# Altium project PCB_Project.PrjPcb
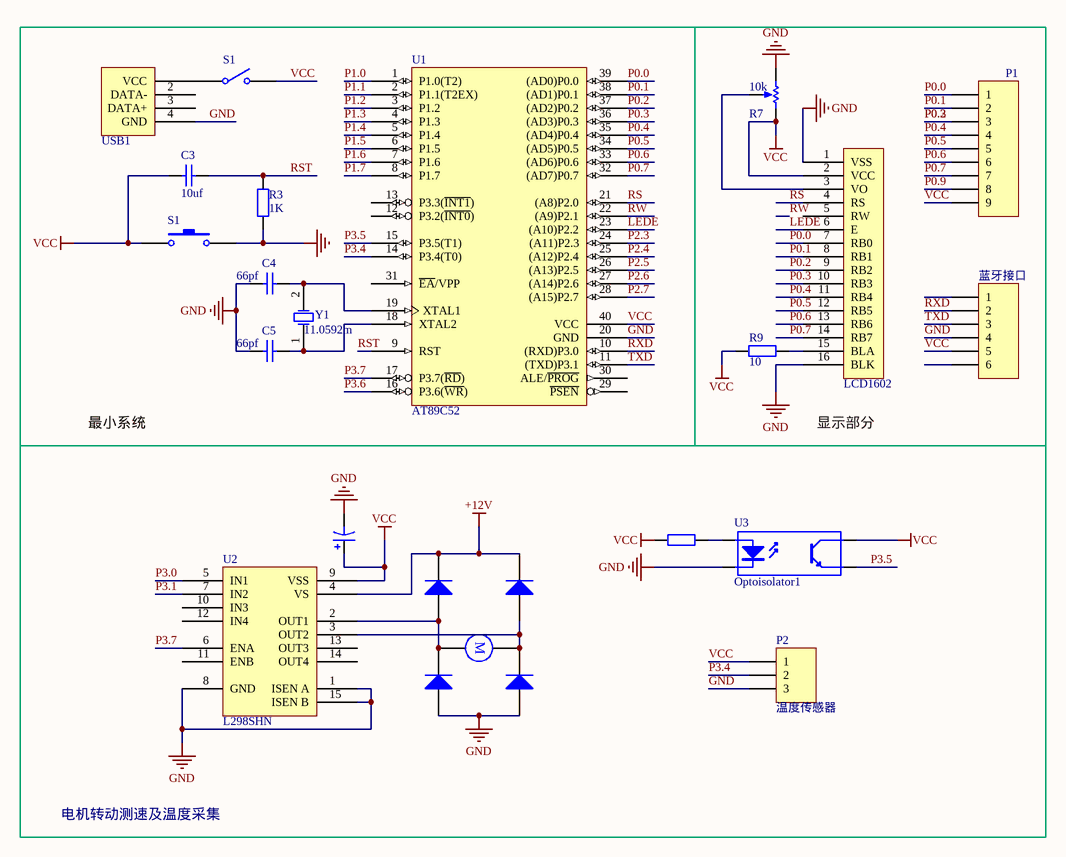
[diagram p0: Sheet1.SchDoc]
1 sheet, 24 parts. Net scope: global (net labels, ports and power ports of the same name join across sheets).

## Sheet Sheet1.SchDoc
size A4

### Parts
(Parts that share a designator on the sheet are numbered #1, #2 ... from top to bottom, then left to right.)
?  USB1  [HDR1X4H]
B?  Motor  [RB5-10.5]  (value not drawn)
C3  10uf  [电容]
C4  66pf  [电容]
C5  66pf  [电容]
C?  Cap Pol1  [RB7.6-15]  (value not drawn)
D?#1  Diode  [SMC]  (value not drawn)
D?#2  Diode  [SMC]  (value not drawn)
D?#3  Diode  [SMC]  (value not drawn)
D?#4  Diode  [SMC]  (value not drawn)
LCD1602  LCD1602  [LCD]  (value not drawn)
P1  Header 9  [paizhu]  (value not drawn)
P2  温度传感器  [HDR1X3H]
R3  1K  [RES]
R7  10k  [VR5]
R9  10  [AXIAL-0.4]
R?  Res2  [AXIAL-0.4]  (value not drawn)
S1#1  SW-SPST  [SPST-2]  (value not drawn)
S1#2  SW-PB  [swith]  (value not drawn)
U1  AT89C52  [AT89C51]
U2  L298SHN
U3  Optoisolator1  [DIP-4]
Y1  11.0592m  [jingti]
蓝牙接口  Header 6H  [HDR1X6H]  (value not drawn)

### Blocks framed on the sheet
最小系统: ? C3-C5 R3 S1#1 S1#2 U1 Y1

### Nets
+12V: D?#1.2(K) D?#2.2(K) U2.4(VS)
GND: ?.4(GND) C4.1 C5.1 C?.2 D?#3.1(A) D?#4.1(A) LCD1602.1(VSS) LCD1602.16(BLK) P2.3 R3.2 R7.1(TOP) S1#2.2 U1.20(GND) U2.1(ISEN_A) U2.8(GND) U2.15(ISEN_B) U3.2(K) 蓝牙接口.4
VCC: C3.2 C?.1 LCD1602.2(VCC) P1.9 P2.1 R7.2(BOT) R9.1 R?.1 S1#2.1 U1.40(VCC) U2.9(VSS) U3.4(C) 蓝牙接口.5
LEDE: LCD1602.6(E) U1.23((A10)P2.2)
P0.0: LCD1602.7(RB0) P1.1 U1.39((AD0)P0.0)
P0.1: LCD1602.8(RB1) P1.2 U1.38((AD1)P0.1)
P0.2: LCD1602.9(RB2) LCD1602.10(RB3) P1.3 U1.36((AD3)P0.3) U1.37((AD2)P0.2)  [also labelled P0.3]
P0.4: LCD1602.11(RB4) P1.4 U1.35((AD4)P0.4)
P0.5: LCD1602.12(RB5) P1.5 U1.34((AD5)P0.5)
P0.6: LCD1602.13(RB6) P1.6 U1.33((AD6)P0.6)
P0.7: LCD1602.14(RB7) P1.7 U1.32((AD7)P0.7)
P0.9: P1.8
P1.0: U1.1(P1.0(T2))
P1.1: U1.2(P1.1(T2EX))
P1.2: U1.3(P1.2)
P1.3: U1.4(P1.3)
P1.4: U1.5(P1.4)
P1.5: U1.6(P1.5)
P1.6: U1.7(P1.6)
P1.7: U1.8(P1.7)
P2.3: U1.24((A11)P2.3)
P2.4: U1.25((A12)P2.4)
P2.5: U1.26((A13)P2.5)
P2.6: U1.27((A14)P2.6)
P2.7: U1.28((A15)P2.7)
P3.0: U2.5(IN1)
P3.1: U2.7(IN2)
P3.4: P2.2 U1.14(P3.4(T0))
P3.5: U1.15(P3.5(T1)) U3.3(E)
P3.6: U1.16(P3.6(~{WR}))
P3.7: U1.17(P3.7(~{RD})) U2.6(ENA)
RS: LCD1602.4(RS) U1.21((A8)P2.0)
RST: C3.1 R3.1 U1.9(RST)
RW: U1.22((A9)P2.1)
RXD: U1.10((RXD)P3.0) 蓝牙接口.2
TXD: U1.11((TXD)P3.1) 蓝牙接口.3
Net?_1: ?.1(VCC) S1#1.1(COMMON)
NetB?_1: B?.1 D?#2.1(A) D?#4.2(K) U2.3(OUT2)
NetB?_2: B?.2 D?#1.1(A) D?#3.2(K) U2.2(OUT1)
NetC4_2: C4.2 U1.19(XTAL1) Y1.2(OSC2)
NetC5_2: C5.2 U1.18(XTAL2) Y1.1(OSC1)
NetLCD1602_3: LCD1602.3(VO) R7.3(TAP)
NetLCD1602_15: LCD1602.15(BLA) R9.2
NetR?_2: R?.2 U3.1(A)

Not connected (* = marked no-connect by the designer): ? 2(DATA-) 3(DATA+); LCD1602 5(RW); S1#1 2(NO); U1 12(P3.2(~{INT0})) 13(P3.3(~{INT1})) 29(~{PSEN}) 30(ALE/~{PROG}) 31(~{EA}/VPP); U2 10(IN3) 11(ENB) 12(IN4) 13(OUT3) 14(OUT4); 蓝牙接口 1 6

### Notes on the sheet
- 显示部分
- 电机转动测速及温度采集
- Labels drawn without touching a wire or pin: VCC
- (in symbol Motor) M

### Library data of the parts
? = USB1: Header, 4-Pin, Right Angle; LatestRevisionDate: 17-Jul-2002; LatestRevisionNote: Re-released for DXP Platform.; Publisher: Altium Limited
B? = Motor: Motor, General Kind; Published: 24-Mar-1999; LatestRevisionDate: 17-Jul-2002; LatestRevisionNote: Re-released for DXP Platform.; PackageReference: RB5-10.5; Publisher: Altium Limited; PackageDescription: Capacitor (Radial); 2 Leads
C3 = Cap: Capacitor; Value: 10mf; Published: 8-Jun-2000; LatestRevisionDate: 17-Jul-2002; LatestRevisionNote: Re-released for DXP Platform.; PackageReference: RAD-0.3; Publisher: Altium Limited; PackageDescription: Radial Cap, Thru-Hole; 2 Leads; 0.3 in Pin Spacing
C4 C5 = Cap: Capacitor; Published: 8-Jun-2000; LatestRevisionDate: 17-Jul-2002; LatestRevisionNote: Re-released for DXP Platform.; PackageReference: RAD-0.3; Publisher: Altium Limited; PackageDescription: Radial Cap, Thru-Hole; 2 Leads; 0.3 in Pin Spacing; Value: 66pf
C? = Cap Pol1: Polarized Capacitor (Radial); Value: 100pF; Published: 8-Jun-2000; LatestRevisionDate: 17-Jul-2002; LatestRevisionNote: Re-released for DXP Platform.; PackageReference: RB7.6-15; Publisher: Altium Limited; PackageDescription: Polarized Capacitor (Radial); 2 Leads
D?#1-D?#4 = Diode: Default Diode; Published: 8-Jun-2000; LatestRevisionDate: 17-Jul-2002; LatestRevisionNote: Re-released for DXP Platform.; PackageVersion: Sep-1996; PackageReference: SMC; Publisher: Altium Limited; PackageDescription: DO-214-AB/SMC; 2 C-Bend Leads; Body 7.9 x 5.9 mm, inc. leads (LxW); Code_JEDEC: DO-214-AB
P1 = Header 9: Header, 9-Pin; LatestRevisionDate: 17-Jul-2002; LatestRevisionNote: Re-released for DXP Platform.; Publisher: Altium Limited
P2 = Header 3H: Header, 3-Pin, Right Angle; LatestRevisionDate: 17-Jul-2002; LatestRevisionNote: Re-released for DXP Platform.; Publisher: Altium Limited
R3 R9 = Res2: Resistor; Published: 8-Jun-2000; LatestRevisionDate: 17-Jul-2002; LatestRevisionNote: Re-released for DXP Platform.; PackageReference: AXIAL-0.4; Publisher: Altium Limited; PackageDescription: Axial Device, Thru-Hole; 2 Leads; 0.4 in Pin Spacing
  R3: Value: 1K
  R9: Value: 10
R7 = RPot: Potentiometer; Sim Note: Enter the Resistance value and the set point into parameter fields.; Set Position: 0.5; Value: 1K; Published: 8-Jun-2000; LatestRevisionDate: 17-Jul-2002; LatestRevisionNote: Re-released for DXP Platform.; PackageReference: VR5; Publisher: Altium Limited; PackageDescription: Variable Resistor, Thru-Hole; 3 Leads
R? = Res2: Resistor; Value: 1K; Published: 8-Jun-2000; LatestRevisionDate: 17-Jul-2002; LatestRevisionNote: Re-released for DXP Platform.; PackageReference: AXIAL-0.4; Publisher: Altium Limited; PackageDescription: Axial Device, Thru-Hole; 2 Leads; 0.4 in Pin Spacing
S1#1 = SW-SPST: Single-Pole, Single-Throw Switch; Published: 24-Mar-1999; LatestRevisionDate: 17-Jul-2002; LatestRevisionNote: Re-released for DXP Platform.; PackageReference: SPST-2; Publisher: Altium Limited; PackageDescription: Switch; 2 Leads
S1#2 = SW-PB: Switch; Published: 24-Mar-1999; LatestRevisionDate: 17-Jul-2002; LatestRevisionNote: Re-released for DXP Platform.; PackageReference: SPST-2; Publisher: Altium Limited; PackageDescription: Switch; 2 Leads
U1 = AT89C52: 8-Bit Microcontroller with 8K Flash ROM
U3 = Optoisolator1: 4-Pin Phototransistor Optocoupler; Published: 24-Mar-1999; LatestRevisionDate: 04-Mar-2005; LatestRevisionNote: Sch pins 3 & 4 Swapped.; DatasheetVersion: Nov-2003; PackageReference: DIP-4; Publisher: Altium Limited
Y1 = XTAL: Crystal Oscillator; Published: 8-Jun-2000; LatestRevisionDate: 17-Jul-2002; LatestRevisionNote: Re-released for DXP Platform.; PackageReference: R38; Publisher: Altium Limited; PackageDescription: Crystal, Thru-Hole; 2 Leads; Body 3.1 x 8.2 mm (Dia.xH)
蓝牙接口 = Header 6H: Header, 6-Pin, Right Angle; LatestRevisionDate: 17-Jul-2002; LatestRevisionNote: Re-released for DXP Platform.; Publisher: Altium Limited